# Altium schematic sheet MCU.SchDoc
size A3; Organization: Altium Limited; Address1: L3, 12a Rodborough Rd; Address2: Frenchs Forest; Address3: NSW; Address4: Australia 2086
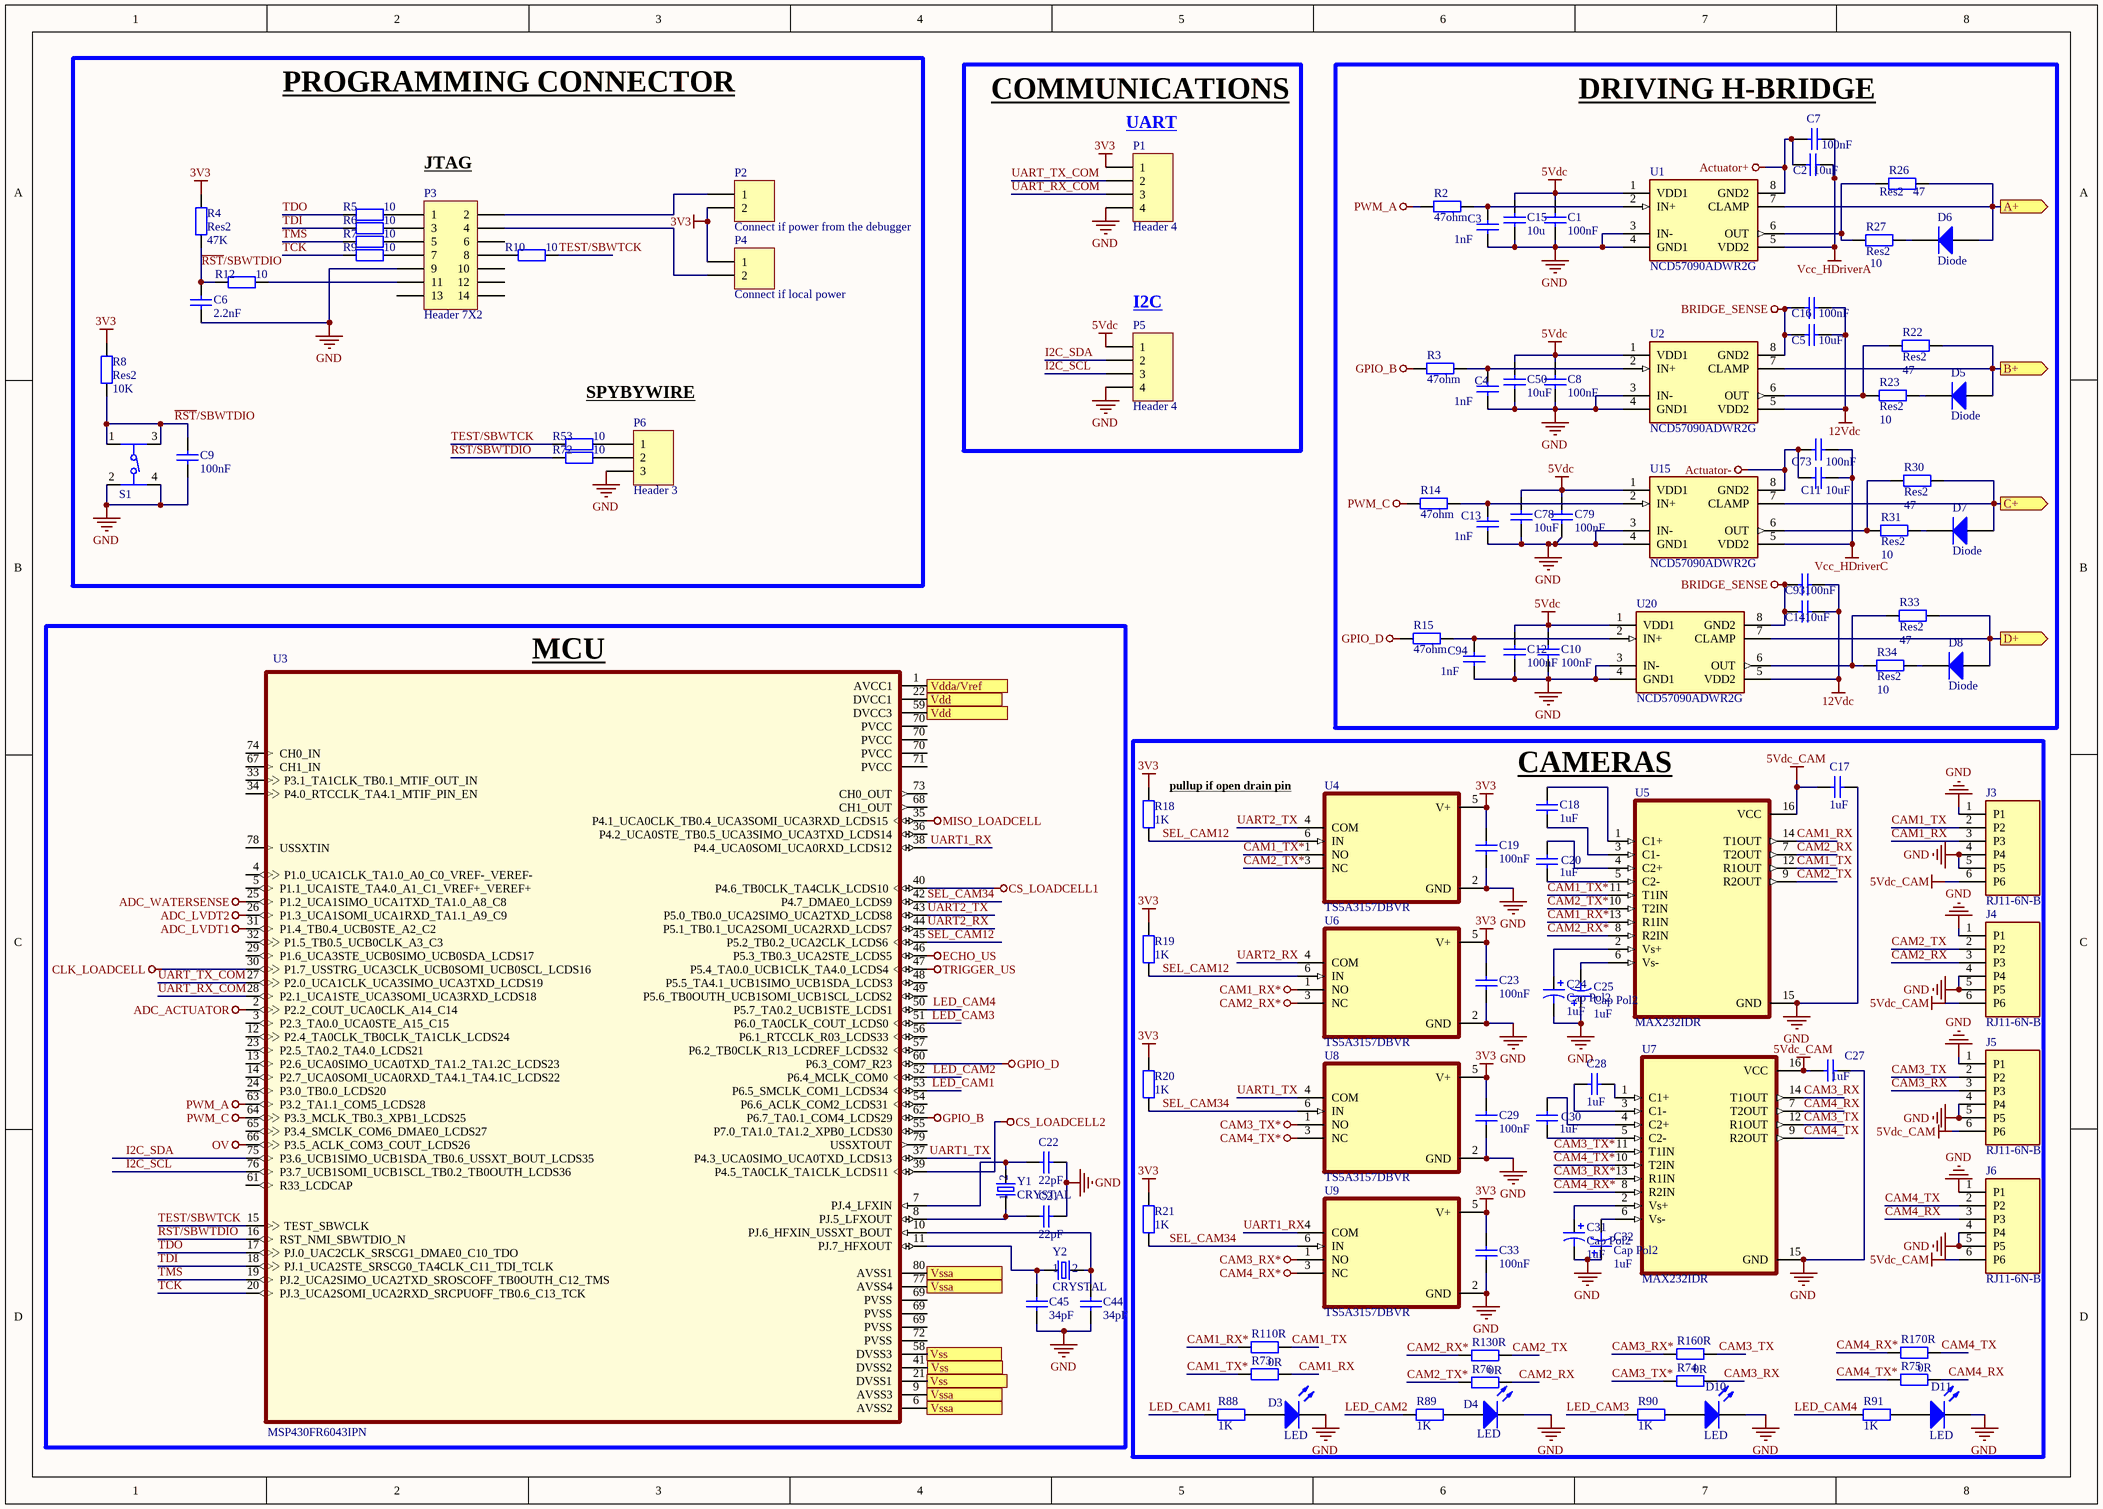
[diagram p0: MCU.SchDoc]

## Parts
C1  value 100nF  [1206]  (hidden comment: Cap)
C2  value 10uF  [1206]  (hidden comment: Cap)
C3  value 1nF  [0603 - duplicate]  (hidden comment: Cap)
C4  value 1nF  [0603 - duplicate]  (hidden comment: Cap)
C5  value 10uF  [1206]  (hidden comment: Cap)
C6  value 2.2nF  [0603 - duplicate]  (hidden comment: Cap)
C7  value 100nF  [1206]  (hidden comment: Cap)
C8  value 100nF  [1206]  (hidden comment: Cap)
C9  value 100nF  [0603 - duplicate]  (hidden comment: Cap)
C10  value 100nF  [1206]  (hidden comment: Cap)
C11  value 10uF  [1206]  (hidden comment: Cap)
C12  value 100nF  [1206]  (hidden comment: Cap)
C13  value 1nF  [0603 - duplicate]  (hidden comment: Cap)
C14  value 10uF  [1206]  (hidden comment: Cap)
C15  value 10u  [1206]  (hidden comment: Cap)
C16  value 100nF  [1206]  (hidden comment: Cap)
C17  value 1uF  [0603 - duplicate]  (hidden comment: Cap)
C18  value 1uF  [0603 - duplicate]  (hidden comment: Cap)
C19  value 100nF  [0603 - duplicate]  (hidden comment: Cap)
C20  value 1uF  [0603 - duplicate]  (hidden comment: Cap)
C21  value 22pF  [0603 - duplicate]  (hidden comment: Cap)
C22  value 22pF  [0603 - duplicate]  (hidden comment: Cap)
C23  value 100nF  [0603 - duplicate]  (hidden comment: Cap)
C24  Cap Pol2  value 1uF  [ElectrolythicCap_2mm]
C25  Cap Pol2  value 1uF  [ElectrolythicCap_2mm]
C27  value 1uF  [0603 - duplicate]  (hidden comment: Cap)
C28  value 1uF  [0603 - duplicate]  (hidden comment: Cap)
C29  value 100nF  [0603 - duplicate]  (hidden comment: Cap)
C30  value 1uF  [0603 - duplicate]  (hidden comment: Cap)
C31  Cap Pol2  value 1uF  [ElectrolythicCap_2mm]
C32  Cap Pol2  value 1uF  [ElectrolythicCap_2mm]
C33  value 100nF  [0603 - duplicate]  (hidden comment: Cap)
C44  value 34pF  [0603 - duplicate]  (hidden comment: Cap)
C45  value 34pF  [0603 - duplicate]  (hidden comment: Cap)
C50  value 10uF  [1206]  (hidden comment: Cap)
C73  value 100nF  [1206]  (hidden comment: Cap)
C78  value 10uF  [1206]  (hidden comment: Cap)
C79  value 100nF  [1206]  (hidden comment: Cap)
C93  value 100nF  [1206]  (hidden comment: Cap)
C94  value 1nF  [0603 - duplicate]  (hidden comment: Cap)
D3  LED  [LED 1206]
D4  LED  [LED 1206]
D5  Diode  [do-214ac]
D6  Diode  [do-214ac]
D7  Diode  [do-214ac]
D8  Diode  [do-214ac]
D10  LED  [LED 1206]
D11  LED  [LED 1206]
J3  RJ11-6N-B  [TE_RJ11-6N-B]
J4  RJ11-6N-B  [TE_RJ11-6N-B]
J5  RJ11-6N-B  [TE_RJ11-6N-B]
J6  RJ11-6N-B  [TE_RJ11-6N-B]
P1  Header 4  [regleta_4]
P2  Connect if power from the debugger  [HDR1X2]
P3  Header 7X2  [HDR2X7]
P4  Connect if local power  [HDR1X2]
P5  Header 4  [regleta_4]
P6  Header 3  [HDR1X3]
R2  value 47ohm  [0603 - duplicate]  (hidden comment: Res2)
R3  value 47ohm  [0603 - duplicate]  (hidden comment: Res2)
R4  Res2  value 47K  [0603 - duplicate]
R5  value 10  [0603 - duplicate]  (hidden comment: Res2)
R6  value 10  [0603 - duplicate]  (hidden comment: Res2)
R7  value 10  [0603 - duplicate]  (hidden comment: Res2)
R8  Res2  value 10K  [0603 - duplicate]
R9  value 10  [0603 - duplicate]  (hidden comment: Res2)
R10  value 10  [0603 - duplicate]  (hidden comment: Res2)
R11  value 0R  [0603 - duplicate]  (hidden comment: Res2)
R12  value 10  [0603 - duplicate]  (hidden comment: Res2)
R13  value 0R  [0603 - duplicate]  (hidden comment: Res2)
R14  value 47ohm  [0603 - duplicate]  (hidden comment: Res2)
R15  value 47ohm  [0603 - duplicate]  (hidden comment: Res2)
R16  value 0R  [0603 - duplicate]  (hidden comment: Res2)
R17  value 0R  [0603 - duplicate]  (hidden comment: Res2)
R18  value 1K  [0603 - duplicate]  (hidden comment: Res2)
R19  value 1K  [0603 - duplicate]  (hidden comment: Res2)
R20  value 1K  [0603 - duplicate]  (hidden comment: Res2)
R21  value 1K  [0603 - duplicate]  (hidden comment: Res2)
R22  Res2  value 47  [0603 - duplicate]
R23  Res2  value 10  [1206]
R26  Res2  value 47  [0603 - duplicate]
R27  Res2  value 10  [1206]
R30  Res2  value 47  [0603 - duplicate]
R31  Res2  value 10  [1206]
R33  Res2  value 47  [0603 - duplicate]
R34  Res2  value 10  [1206]
R53  value 10  [0603 - duplicate]  (hidden comment: Res2)
R72  value 10  [0603 - duplicate]  (hidden comment: Res2)
R73  value 0R  [0603 - duplicate]  (hidden comment: Res2)
R74  value 0R  [0603 - duplicate]  (hidden comment: Res2)
R75  value 0R  [0603 - duplicate]  (hidden comment: Res2)
R76  value 0R  [0603 - duplicate]  (hidden comment: Res2)
R88  value 1K  [0603 - duplicate]  (hidden comment: Res2)
R89  value 1K  [0603 - duplicate]  (hidden comment: Res2)
R90  value 1K  [0603 - duplicate]  (hidden comment: Res2)
R91  value 1K  [0603 - duplicate]  (hidden comment: Res2)
S1  430182070816  [430182070816]  (value not drawn)
U1  NCD57090ADWR2G  [soic8_w]
U2  NCD57090ADWR2G  [soic8_w]
U3  MSP430FR6043IPN  [*QFP50P1400X1400X160-80N]
U4  TS5A3157DBVR  [SOT95P280X145-6N]
U5  MAX232IDR  [SOIC127P600X175-16N]
U6  TS5A3157DBVR  [SOT95P280X145-6N]
U7  MAX232IDR  [SOIC127P600X175-16N]
U8  TS5A3157DBVR  [SOT95P280X145-6N]
U9  TS5A3157DBVR  [SOT95P280X145-6N]
U15  NCD57090ADWR2G  [soic8_w]
U20  NCD57090ADWR2G  [soic8_w]
Y1  CRYSTAL  [XTAL320X150X90]
Y2  CRYSTAL  [XTAL_ABM7-16.000MHZ-D2Y-T]

## Blocks framed on the sheet
PROGRAMMING CONNECTOR: C6 C9 P2-P4 P6 R4-R10 R12 R53 R72 S1
COMMUNICATIONS: P1 P5
DRIVING H-BRIDGE: C1-C5 C7 C8 C10-C16 C50 C73 C78 C79 C93 C94 D5-D8 R2 R3 R14 R15 R22 R23 R26 R27 R30 R31 R33 R34 U1 U2 U15 U20
MCU: C21 C22 C44 C45 U3 Y1 Y2
CAMERAS: C17-C20 C23-C25 C27-C33 D3 D4 D10 D11 J3-J6 R11 R13 R16-R21 R73-R76 R88-R91 U4-U9

## Ports
A+ (out), B+ (out), C+ (out), D+ (out), Vdd, Vdda/Vref, Vss, Vssa

## Nets
3V3: C19.2 C23.2 C29.2 C33.2 P1.1 P2.2 P4.1 R4.2 R8.2 R18.1 R19.1 R20.1 R21.1 U4.5(V+) U6.5(V+) U8.5(V+) U9.5(V+)
5Vdc: C1.1 C8.2 C10.1 C12.1 C15.1 C50.2 C78.2 C79.2 P5.1 U1.1(VDD1) U2.1(VDD1) U15.1(VDD1) U20.1(VDD1)
5Vdc_CAM: C17.2 C27.2 J3.6(P6) J4.6(P6) J5.6(P6) J6.6(P6) U5.16(VCC) U7.16(VCC)
12Vdc: C5.1 C14.1 C16.1 C93.1 U2.5(VDD2) U20.5(VDD2)
Actuator+: C2.2 C7.2 U1.8(GND2)
Actuator-: C11.2 C73.2 U15.8(GND2)
ADC_ACTUATOR: U3.2(P2.2_COUT_UCA0CLK_A14_C14)
ADC_LVDT1: U3.31(P1.4_TB0.4_UCB0STE_A2_C2)
ADC_LVDT2: U3.26(P1.3_UCA1SOMI_UCA1RXD_TA1.1_A9_C9)
ADC_WATERSENSE: U3.25(P1.2_UCA1SIMO_UCA1TXD_TA1.0_A8_C8)
BRIDGE_SENSE: C5.2 C14.2 C16.2 C93.2 U2.8(GND2) U20.8(GND2)
CAM1_RX*: R11.1 U5.13(R1IN) U6.1(NO)
CAM2_RX*: R13.1 U5.8(R2IN) U6.3(NC)
CAM3_RX*: R16.1 U7.13(R1IN) U9.1(NO)
CAM3_TX*: R74.1 U7.11(T1IN) U8.1(NO)
CAM4_RX*: R17.1 U7.8(R2IN) U9.3(NC)
CAM4_TX*: R75.1 U7.10(T2IN) U8.3(NC)
CLK_LOADCELL: U3.30(P1.7_USSTRG_UCA3CLK_UCB0SOMI_UCB0SCL_LCDS16)
CS_LOADCELL1: U3.40(P4.6_TB0CLK_TA4CLK_LCDS10)
CS_LOADCELL2: U3.39(P4.5_TA0CLK_TA1CLK_LCDS11)
ECHO_US: U3.46(P5.3_TB0.3_UCA2STE_LCDS5)
GND: C1.2 C3.2 C4.2 C6.1 C8.1 C9.1 C10.2 C12.2 C13.2 C15.2 C17.1 C19.1 C21.1 C22.1 C23.1 C24.N C25.P C27.1 C29.1 C31.N C32.P C33.1 C44.1 C45.1 C50.1 C78.1 C79.1 C94.2 D3.2(K) D4.2(K) D10.2(K) D11.2(K) J3.1(P1) J3.4(P4) J3.5(P5) J4.1(P1) J4.4(P4) J4.5(P5) J5.1(P1) J5.4(P4) J5.5(P5) J6.1(P1) J6.4(P4) J6.5(P5) P1.4 P3.9 P5.4 P6.3 S1.2 S1.4 U1.3(IN-) U1.4(GND1) U2.3(IN-) U2.4(GND1) U4.2(GND) U5.15(GND) U6.2(GND) U7.15(GND) U8.2(GND) U9.2(GND) U15.3(IN-) U15.4(GND1) U20.3(IN-) U20.4(GND1)
GPIO_B: R3.2 U3.62(P6.7_TA0.1_COM4_LCDS29)
GPIO_D: R15.2 U3.60(P6.3_COM7_R23)
MISO_LOADCELL: U3.35(P4.1_UCA0CLK_TB0.4_UCA3SOMI_UCA3RXD_LCDS15)
OV: U3.66(P3.5_ACLK_COM3_COUT_LCDS26)
PWM_A: R2.2 U3.63(P3.2_TA1.1_COM5_LCDS28)
PWM_C: R14.2 U3.64(P3.3_MCLK_TB0.3_XPB1_LCDS25)
TRIGGER_US: U3.47(P5.4_TA0.0_UCB1CLK_TA4.0_LCDS4)
Vcc_HDriverA: C2.1 C7.1 U1.5(VDD2)
Vcc_HDriverC: C11.1 C73.1 U15.5(VDD2)
~{RST}/SBWTDIO: C6.2 C9.2 R4.1 R8.1 R12.2 R72.2 S1.1 S1.3 U3.16(RST_NMI_SBWTDIO_N)
A+: D6.1(A) R26.2 U1.7(CLAMP) ; port A+
B+: D5.1(A) R22.2 U2.7(CLAMP) ; port B+
C+: D7.1(A) R30.2 U15.7(CLAMP) ; port C+
CAM1_RX: J3.3(P3) R73.2 U5.14(T1OUT)
CAM1_TX: J3.2(P2) R11.2 U5.12(R1OUT)
CAM1_TX*: R73.1 U4.1(NO) U5.11(T1IN)
CAM2_RX: J4.3(P3) R76.2 U5.7(T2OUT)
CAM2_TX: J4.2(P2) R13.2 U5.9(R2OUT)
CAM2_TX*: R76.1 U4.3(NC) U5.10(T2IN)
CAM3_RX: J5.3(P3) R74.2 U7.14(T1OUT)
CAM3_TX: J5.2(P2) R16.2 U7.12(R1OUT)
CAM4_RX: J6.3(P3) R75.2 U7.7(T2OUT)
CAM4_TX: J6.2(P2) R17.2 U7.9(R2OUT)
D+: D8.1(A) R33.2 U20.7(CLAMP) ; port D+
I2C_SCL: P5.3 U3.76(P3.7_UCB1SOMI_UCB1SCL_TB0.2_TB0OUTH_LCDS36)
I2C_SDA: P5.2 U3.75(P3.6_UCB1SIMO_UCB1SDA_TB0.6_USSXT_BOUT_LCDS35)
LED_CAM1: R88.1 U3.53(P6.5_SMCLK_COM1_LCDS34)
LED_CAM2: R89.1 U3.52(P6.4_MCLK_COM0)
LED_CAM3: R90.1 U3.51(P6.0_TA0CLK_COUT_LCDS0)
LED_CAM4: R91.1 U3.50(P5.7_TA0.2_UCB1STE_LCDS1)
SEL_CAM12: R18.2 R19.2 U3.45(P5.2_TB0.2_UCA2CLK_LCDS6) U4.6(IN) U6.6(IN)
SEL_CAM34: R20.2 R21.2 U3.42(P4.7_DMAE0_LCDS9) U8.6(IN) U9.6(IN)
TCK: R9.2 U3.20(PJ.3_UCA2SOMI_UCA2RXD_SRCPUOFF_TB0.6_C13_TCK)
TDI: R6.2 U3.18(PJ.1_UCA2STE_SRSCG0_TA4CLK_C11_TDI_TCLK)
TDO: R5.2 U3.17(PJ.0_UAC2CLK_SRSCG1_DMAE0_C10_TDO)
TEST/SBWTCK: R10.1 R53.2 U3.15(TEST_SBWCLK)
TMS: R7.2 U3.19(PJ.2_UCA2SIMO_UCA2TXD_SROSCOFF_TB0OUTH_C12_TMS)
UART1_RX: U3.38(P4.4_UCA0SOMI_UCA0RXD_LCDS12) U9.4(COM)
UART1_TX: U3.37(P4.3_UCA0SIMO_UCA0TXD_LCDS13) U8.4(COM)
UART2_RX: U3.44(P5.1_TB0.1_UCA2SOMI_UCA2RXD_LCDS7) U6.4(COM)
UART2_TX: U3.43(P5.0_TB0.0_UCA2SIMO_UCA2TXD_LCDS8) U4.4(COM)
UART_RX_COM: P1.3 U3.28(P2.1_UCA1STE_UCA3SOMI_UCA3RXD_LCDS18)
UART_TX_COM: P1.2 U3.27(P2.0_UCA1CLK_UCA3SIMO_UCA3TXD_LCDS19)
Vdd: U3.22(DVCC1) U3.59(DVCC3) ; port Vdd
Vdda/Vref: U3.1(AVCC1) ; port Vdda/Vref
Vss: U3.21(DVSS1) U3.41(DVSS2) U3.58(DVSS3) ; port Vss
Vssa: U3.6(AVSS2) U3.9(AVSS3) U3.77(AVSS4) U3.80(AVSS1) ; port Vssa
NetC3_1: C3.1 R2.1 U1.2(IN+)
NetC4_1: C4.1 R3.1 U2.2(IN+)
NetC13_1: C13.1 R14.1 U15.2(IN+)
NetC18_1: C18.1 U5.1(C1+)
NetC18_2: C18.2 U5.3(C1-)
NetC20_1: C20.1 U5.4(C2+)
NetC20_2: C20.2 U5.5(C2-)
NetC21_2: C21.2 U3.8(PJ.5_LFXOUT) Y1.1
NetC22_2: C22.2 U3.7(PJ.4_LFXIN) Y1.2
NetC24_P: C24.P U5.2(Vs+)
NetC25_N: C25.N U5.6(Vs-)
NetC28_1: C28.1 U7.3(C1-)
NetC28_2: C28.2 U7.1(C1+)
NetC30_1: C30.1 U7.4(C2+)
NetC30_2: C30.2 U7.5(C2-)
NetC31_P: C31.P U7.2(Vs+)
NetC32_N: C32.N U7.6(Vs-)
NetC44_2: C44.2 U3.10(PJ.6_HFXIN_USSXT_BOUT) Y2.2
NetC45_2: C45.2 U3.11(PJ.7_HFXOUT) Y2.1
NetC94_1: C94.1 R15.1 U20.2(IN+)
NetD3_1: D3.1(A) R88.2
NetD4_1: D4.1(A) R89.2
NetD5_2: D5.2(K) R23.2
NetD6_2: D6.2(K) R27.2
NetD7_2: D7.2(K) R31.2
NetD8_2: D8.2(K) R34.2
NetD10_1: D10.1(A) R90.2
NetD11_1: D11.1(A) R91.2
NetP2_1: P2.1 P3.2
NetP3_1: P3.1 R5.1
NetP3_3: P3.3 R6.1
NetP3_4: P3.4 P4.2
NetP3_5: P3.5 R7.1
NetP3_7: P3.7 R9.1
NetP3_8: P3.8 R10.2
NetP3_11: P3.11 R12.1
NetP6_1: P6.1 R53.1
NetP6_2: P6.2 R72.1
NetR22_1: R22.1 R23.1 U2.6(OUT)
NetR26_1: R26.1 R27.1 U1.6(OUT)
NetR30_1: R30.1 R31.1 U15.6(OUT)
NetR33_1: R33.1 R34.1 U20.6(OUT)

Not connected (* = marked no-connect by the designer): P3 6 10 12 13 14; U3 3(P2.3_TA0.0_UCA0STE_A15_C15) 4(P1.0_UCA1CLK_TA1.0_A0_C0_VREF-_VEREF-) 5(P1.1_UCA1STE_TA4.0_A1_C1_VREF+_VEREF+) 12(P2.4_TA0CLK_TB0CLK_TA1CLK_LCDS24) 13(P2.6_UCA0SIMO_UCA0TXD_TA1.2_TA1.2C_LCDS23) 14(P2.7_UCA0SOMI_UCA0RXD_TA4.1_TA4.1C_LCDS22) 23(P2.5_TA0.2_TA4.0_LCDS21) 24(P3.0_TB0.0_LCDS20) 29(P1.6_UCA3STE_UCB0SIMO_UCB0SDA_LCDS17) 32(P1.5_TB0.5_UCB0CLK_A3_C3) 33(P3.1_TA1CLK_TB0.1_MTIF_OUT_IN) 34(P4.0_RTCCLK_TA4.1_MTIF_PIN_EN) 36(P4.2_UCA0STE_TB0.5_UCA3SIMO_UCA3TXD_LCDS14) 48(P5.5_TA4.1_UCB1SIMO_UCB1SDA_LCDS3) 49(P5.6_TB0OUTH_UCB1SOMI_UCB1SCL_LCDS2) 54(P6.6_ACLK_COM2_LCDS31) 55(P7.0_TA1.0_TA1.2_XPB0_LCDS30) 56(P6.1_RTCCLK_R03_LCDS33) 57(P6.2_TB0CLK_R13_LCDREF_LCDS32) 61(R33_LCDCAP) 65(P3.4_SMCLK_COM6_DMAE0_LCDS27) 67(CH1_IN) 68(CH1_OUT) 69(PVSS) 70(PVCC) 71(PVCC) 72(PVSS) 73(CH0_OUT) 74(CH0_IN) 78(USSXTIN) 79(USSXTOUT)

## Notes on the sheet
- We will have two options to program the uC. We only need one, so we have to solder only 2 of the 4 zero ohm resistors, two of one of the two connectors.
- JTAG
- (near P1) UART
- (near P5) I2C
- SPYBYWIRE
- pullup if open drain pin
- Title
- Size:
- Date:
- A3
- Number:
- Time:
- Revision:
- Sheet
- of
- File:

## Library data of the parts
C1-C23 C27-C30 C33 C44 C45 C50 C73 C78 C79 C93 C94 = Cap: Capacitor; Published: 8-Jun-2000; LatestRevisionDate: 17-Jul-2002; LatestRevisionNote: Re-released for DXP Platform.; PackageReference: RAD-0.3; Publisher: Altium Limited; PackageDescription: Radial Cap, Thru-Hole; 2 Leads; 0.3 in Pin Spacing
C24 C25 C31 C32 = Cap Pol2: Polarized Capacitor (Axial); Published: 8-Jun-2000; LatestRevisionDate: 17-Jul-2002; LatestRevisionNote: Re-released for DXP Platform.; PackageReference: POLAR0.8; Publisher: Altium Limited; PackageDescription: Polarized Capacitor; 2 Leads
D3 D4 D10 D11 = LED: Typical RED, GREEN, YELLOW, AMBER GaAs LED; Published: 8-Jun-2000; LatestRevisionDate: 17-Jul-2002; LatestRevisionNote: Re-released for DXP Platform.; PackageVersion: Feb-2002; PackageReference: 3.2X1.6X1.1; Publisher: Altium Limited; PackageDescription: SM LED; 2 Flat Leads
D5-D8 = Diode: Default Diode; Published: 8-Jun-2000; LatestRevisionDate: 17-Jul-2002; LatestRevisionNote: Re-released for DXP Platform.; PackageVersion: Sep-1996; PackageReference: SMC; Publisher: Altium Limited; PackageDescription: DO-214-AB/SMC; 2 C-Bend Leads; Body 7.9 x 5.9 mm, inc. leads (LxW); Code_JEDEC: DO-214-AB
J3-J6 = RJ11-6N-B: 6 Position 1 Port Right Angle RJ11 Low Profile Filtered EMI/RFI Modular Jack; MF: TE Connectivity; MP: RJ11-6N-B; Availability: Unavailable; SnapEDA_Link: https://www.snapeda.com/parts/RJ11-6N-B/TE%20Connectivity%20Corcom%20Filters/view-part/2771781/?ref=snap; Package: None; Price: None; TE_purchase_URL: https://www.te.com/usa-en/product-6609212-4.html?te_bu=Cor&te_type=disp&te_campaign=seda_glo_cor-seda-global-disp-prtnr-fy19-seda-model-bom-cta_sma-317_1&elqCampaignId=32493; Value: *
P1 P5 = Header 4: Header, 4-Pin; LatestRevisionDate: 17-Jul-2002; LatestRevisionNote: Re-released for DXP Platform.; Publisher: Altium Limited
P2 P4 = Header 2: Header, 2-Pin; LatestRevisionDate: 17-Jul-2002; LatestRevisionNote: Re-released for DXP Platform.; Publisher: Altium Limited
P3 = Header 7X2: Header, 7-Pin, Dual row; LatestRevisionDate: 17-Jul-2002; LatestRevisionNote: Re-released for DXP Platform.; Publisher: Altium Limited
P6 = Header 3: Header, 3-Pin; LatestRevisionDate: 17-Jul-2002; LatestRevisionNote: Re-released for DXP Platform.; Publisher: Altium Limited
R2-R23 R26 R27 R30 R31 R33 R34 R53 R72-R76 R88-R91 = Res2: Resistor; Published: 8-Jun-2000; LatestRevisionDate: 17-Jul-2002; LatestRevisionNote: Re-released for DXP Platform.; PackageReference: AXIAL-0.4; Publisher: Altium Limited; PackageDescription: Axial Device, Thru-Hole; 2 Leads; 0.4 in Pin Spacing
S1 = 430182070816: Tactile Switch SPST-NO Top Actuated Surface Mount; MF: Wurth Electronics; SnapEDA_Link: https://www.snapeda.com/parts/430182070816/Wurth+Electronics+Inc./view-part/?ref=snap; Package: None; MP: 430182070816; Value: *; Check_prices: https://www.snapeda.com/parts/430182070816/Wurth+Electronics+Inc./view-part/?ref=eda; Availability: Not in stock; Price: None
U1 U2 U15 U20 = NCD57090ADWR2G: Mosfet Gate Driver Isolated; MP: PEME2-S15-D5-S; MF: CUI; Purchase-URL: https://pricing.snapeda.com/search/part/PEME2-S15-D5-S/?ref=eda; Package: None; Value: *; SnapEDA_Link: https://www.snapeda.com/parts/PEME2-S15-D5-S/CUI/view-part/?ref=snap; Availability: In Stock; Price: None; Check_prices: https://www.snapeda.com/parts/PEME2-S15-D5-S/CUI/view-part/?ref=eda
U3 = MSP430FR6043IPN: Ultrasonic Sensing MCU with 64KB FRAM, 12KB RAM, LCD for gas and water metering applications; MF: Texas Instruments; Price: None; Availability: In Stock; SnapEDA_Link: https://www.snapeda.com/parts/MSP430FR6043IPN/Texas+Instruments/view-part/?ref=snap; Check_prices: https://www.snapeda.com/parts/MSP430FR6043IPN/Texas+Instruments/view-part/?ref=eda; Purchase-URL: https://pricing.snapeda.com/search/part/MSP430FR6043IPN/?ref=eda; MP: MSP430FR6043IPN; Package: LQFP-80 Texas Instruments; Value: *
U5 U7 = MAX232IDR: MP: TRS202EID; Package: None; Price: None; Value: *; Availability: Unavailable
Y1 = CRYSTAL: 32.768kHz Â±30ppm Crystal 12.5pF 90 kOhms 2-SMD, No Lead; MF: EPSON; MP: FC-12M; Value: *; Package: SMD-2 EPSON; Price: None; SnapEDA_Link: https://www.snapeda.com/parts/FC-12M/EPSON/view-part/105663/?ref=snap; Availability: Unavailable
Y2 = CRYSTAL: MF: EPSON; MP: FC-12M; Value: *; Package: SMD-2 EPSON; Price: None; SnapEDA_Link: https://www.snapeda.com/parts/FC-12M/EPSON/view-part/105663/?ref=snap; Availability: Unavailable
U4 U6 U8 U9 = TS5A3157DBVR: Package: None; Price: None; Value: *; MP: TS5A3157DBVR; Availability: Unavailable